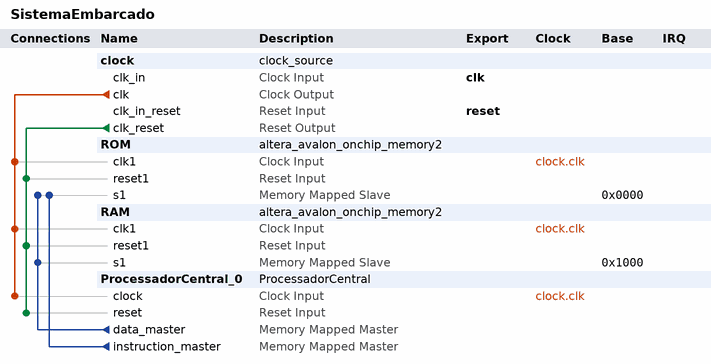
[diagram p0: system contents]
# Platform Designer (Qsys) system SistemaEmbarcado, Cyclone IV E EP4CE115F29C7
# Parameters at their usual value, and those the tool derives, are not listed.
package require -exact qsys 18.1
create_system SistemaEmbarcado
set_project_property DEVICE_FAMILY {Cyclone IV E}
set_project_property DEVICE EP4CE115F29C7

add_instance clock clock_source 18.1
set_instance_parameter_value clock clockFrequency 50000000

add_instance ROM altera_avalon_onchip_memory2 18.1
set_instance_parameter_value ROM allowInSystemMemoryContentEditor true
set_instance_parameter_value ROM dataWidth 32
set_instance_parameter_value ROM dualPort false
set_instance_parameter_value ROM initMemContent true
set_instance_parameter_value ROM initializationFileName {C:/Users/Heverton Reis/Documents/LAB04/ModuloProcessador/instruction_memory.mif}
set_instance_parameter_value ROM instanceID INT
set_instance_parameter_value ROM memorySize 4096
set_instance_parameter_value ROM useNonDefaultInitFile true
set_instance_parameter_value ROM writable false

add_instance RAM altera_avalon_onchip_memory2 18.1
set_instance_parameter_value RAM allowInSystemMemoryContentEditor true
set_instance_parameter_value RAM dataWidth 32
set_instance_parameter_value RAM dualPort false
set_instance_parameter_value RAM initMemContent true
set_instance_parameter_value RAM initializationFileName {C:/Users/Heverton Reis/Documents/LAB04/ModuloProcessador/data_memory.mif}
set_instance_parameter_value RAM instanceID DATA
set_instance_parameter_value RAM memorySize 4096
set_instance_parameter_value RAM useNonDefaultInitFile true

add_instance ProcessadorCentral_0 ProcessadorCentral 1.1

# connections
add_connection clock.clk ProcessadorCentral_0.clock clock
add_connection clock.clk RAM.clk1 clock
add_connection clock.clk ROM.clk1 clock
add_connection clock.clk_reset ProcessadorCentral_0.reset reset
add_connection clock.clk_reset RAM.reset1 reset
add_connection clock.clk_reset ROM.reset1 reset
add_connection ProcessadorCentral_0.data_master RAM.s1 avalon
set_connection_parameter_value ProcessadorCentral_0.data_master/RAM.s1 baseAddress 0x1000
add_connection ProcessadorCentral_0.data_master ROM.s1 avalon
set_connection_parameter_value ProcessadorCentral_0.data_master/ROM.s1 baseAddress 0x0000
add_connection ProcessadorCentral_0.instruction_master ROM.s1 avalon
set_connection_parameter_value ProcessadorCentral_0.instruction_master/ROM.s1 baseAddress 0x0000

# exported interfaces
add_interface clk clock sink
set_interface_property clk EXPORT_OF clock.clk_in
add_interface reset reset sink
set_interface_property reset EXPORT_OF clock.clk_in_reset

set_interconnect_requirement {$system} qsys_mm.clockCrossingAdapter HANDSHAKE
set_interconnect_requirement {$system} qsys_mm.enableEccProtection FALSE
set_interconnect_requirement {$system} qsys_mm.insertDefaultSlave FALSE
set_interconnect_requirement {$system} qsys_mm.maxAdditionalLatency 1

save_system SistemaEmbarcado.qsys
